# Altium schematic sheet FPGA_MGT.SchDoc
size A4; SheetNumber: 4; SheetTotal: 8
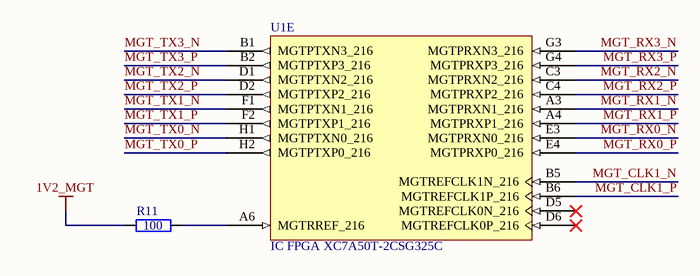
[diagram p0: FPGA_MGT.SchDoc]

## Parts
R11  100  [GEN_R_0201]
U1  IC FPGA XC7A50T-2CSG325C  [XILINX_XC7A50T-2CSG325C]  (part E of 9)

## Nets
1V2_MGT: R11.1
MGT_CLK1_N: U1.B5(MGTREFCLK1N_216)
MGT_CLK1_P: U1.B6(MGTREFCLK1P_216)
MGT_RX0_N: U1.E3(MGTPRXN0_216)
MGT_RX0_P: U1.E4(MGTPRXP0_216)
MGT_RX1_N: U1.A3(MGTPRXN1_216)
MGT_RX1_P: U1.A4(MGTPRXP1_216)
MGT_RX2_N: U1.C3(MGTPRXN2_216)
MGT_RX2_P: U1.C4(MGTPRXP2_216)
MGT_RX3_N: U1.G3(MGTPRXN3_216)
MGT_RX3_P: U1.G4(MGTPRXP3_216)
MGT_TX0_N: U1.H1(MGTPTXN0_216)
MGT_TX0_P: U1.H2(MGTPTXP0_216)
MGT_TX1_N: U1.F1(MGTPTXN1_216)
MGT_TX1_P: U1.F2(MGTPTXP1_216)
MGT_TX2_N: U1.D1(MGTPTXN2_216)
MGT_TX2_P: U1.D2(MGTPTXP2_216)
MGT_TX3_N: U1.B1(MGTPTXN3_216)
MGT_TX3_P: U1.B2(MGTPTXP3_216)
NetR11_2: R11.2 U1.A6(MGTRREF_216)

Not connected (* = marked no-connect by the designer): U1 D5(MGTREFCLK0N_216)* D6(MGTREFCLK0P_216)*

## Library data of the parts
R11 = RES 100 OHM 1% 1/20W 0201: House Part Number: R-100-0201-1%-001; Manufacturer: Yageo; Manufacturer Part Number: RC0201FR-07100RL; Tolerance: 1%; Package: 0201; Value: 100; Supplier 1: Digi-Key; Supplier Part Number 1: 311-100MCT-ND
U1 = IC FPGA XC7A50T-2CSG325C: Artix-7 FPGA, 150 User I/Os, 4 GTP, 324-Ball BGA, Speed Grade 2, Commercial Grade, Pb-Free; Manufacturer: Xilinx; House Part Number: XC7A50T-2CSG325C; Manufacturer Part Number: XC7A50T-2CSG325C; Supplier 1: Digi-Key; Supplier Part Number 1: 122-2193-ND